# Altium schematic sheet IsolatedPeltierDriver.SchDoc
size A4
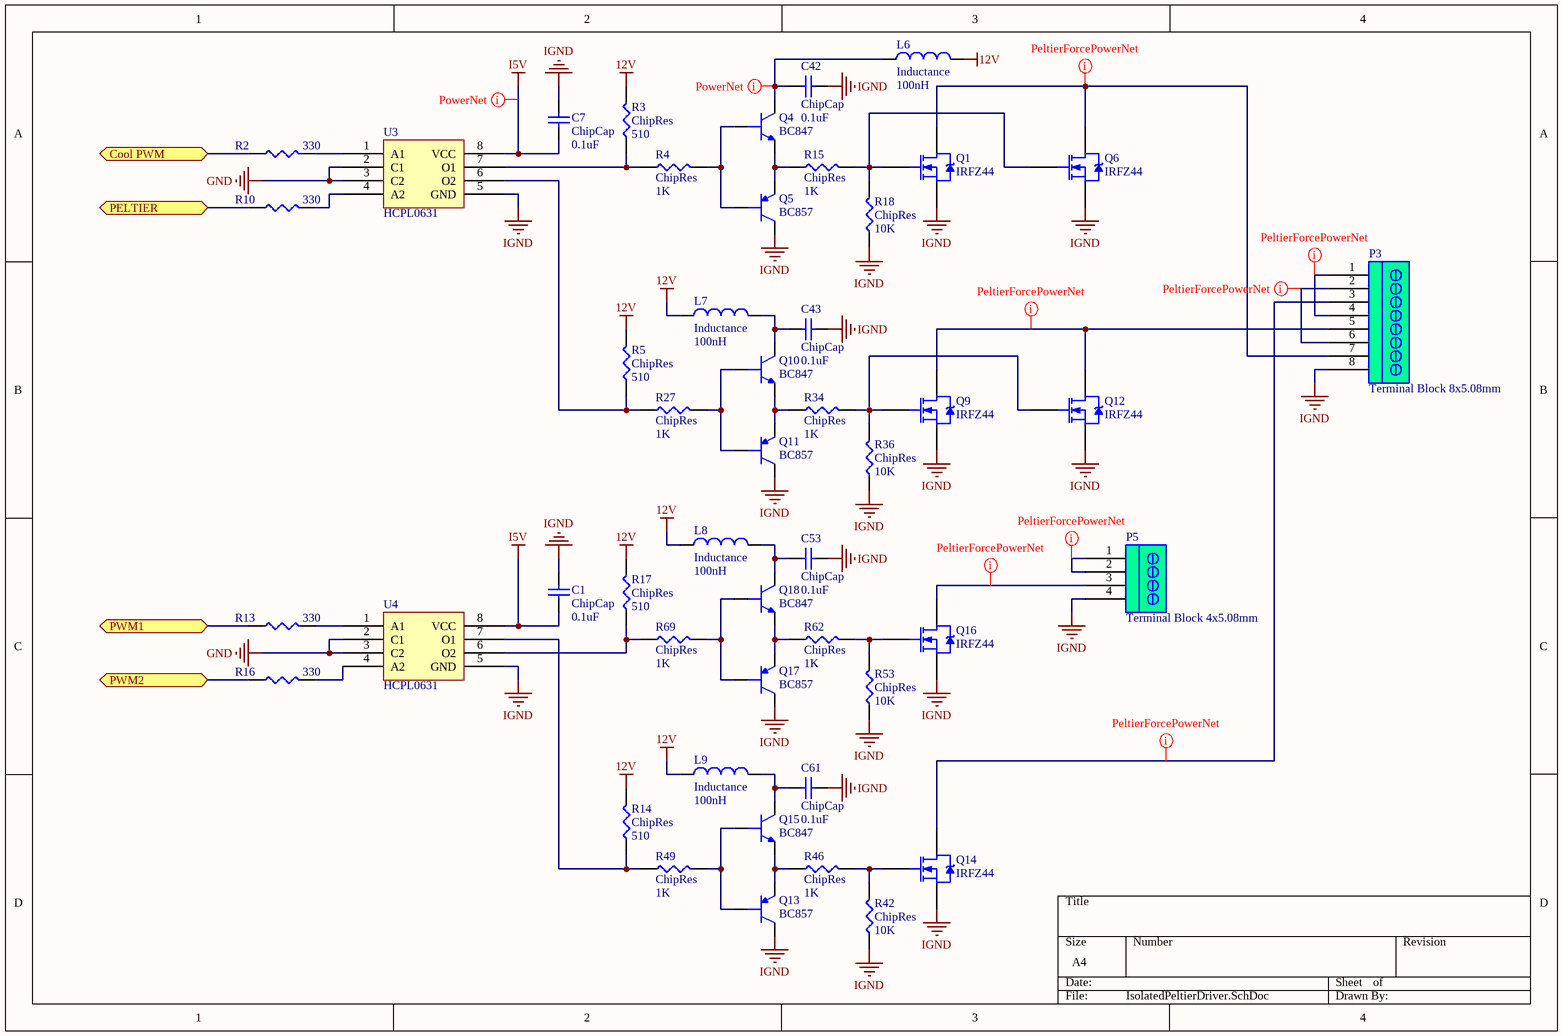
[diagram p0: IsolatedPeltierDriver.SchDoc]

## Parts
C1  ChipCap  value 0.1uF  [CAP0805]
C7  ChipCap  value 0.1uF  [CAP0805]
C42  ChipCap  value 0.1uF  [CAP0805]
C43  ChipCap  value 0.1uF  [CAP0805]
C53  ChipCap  value 0.1uF  [CAP0805]
C61  ChipCap  value 0.1uF  [CAP0805]
L6  Inductance  value 100nH  [CM45]
L7  Inductance  value 100nH  [CM45]
L8  Inductance  value 100nH  [CM45]
L9  Inductance  value 100nH  [CM45]
P3  Terminal Block 8x5.08mm  [SOCKET 8x5.08]
P5  Terminal Block 4x5.08mm  [Socket 4x5.08]
Q1  IRFZ44  [TO-263AB]
Q4  BC847  [SOT23]
Q5  BC857  [SOT23]
Q6  IRFZ44  [TO-263AB]
Q9  IRFZ44  [TO-263AB]
Q10  BC847  [SOT23]
Q11  BC857  [SOT23]
Q12  IRFZ44  [TO-263AB]
Q13  BC857  [SOT23]
Q14  IRFZ44  [TO-263AB]
Q15  BC847  [SOT23]
Q16  IRFZ44  [TO-263AB]
Q17  BC857  [SOT23]
Q18  BC847  [SOT23]
R2  value 330  [RES0805]  (hidden comment: ChipRes)
R3  ChipRes  value 510  [RES0805]
R4  ChipRes  value 1K  [RES0805]
R5  ChipRes  value 510  [RES0805]
R10  value 330  [RES0805]  (hidden comment: ChipRes)
R13  value 330  [RES0805]  (hidden comment: ChipRes)
R14  ChipRes  value 510  [RES0805]
R15  ChipRes  value 1K  [RES0805]
R16  value 330  [RES0805]  (hidden comment: ChipRes)
R17  ChipRes  value 510  [RES0805]
R18  ChipRes  value 10K  [RES0805]
R27  ChipRes  value 1K  [RES0805]
R34  ChipRes  value 1K  [RES0805]
R36  ChipRes  value 10K  [RES0805]
R42  ChipRes  value 10K  [RES0805]
R46  ChipRes  value 1K  [RES0805]
R49  ChipRes  value 1K  [RES0805]
R53  ChipRes  value 10K  [RES0805]
R62  ChipRes  value 1K  [RES0805]
R69  ChipRes  value 1K  [RES0805]
U3  HCPL0631  [SOIC8]
U4  HCPL0631  [SOIC8]

## Ports
Cool PWM, PELTIER, PWM1, PWM2

## Nets
12V: L6.1 L7.2 L8.2 L9.2 R3.2 R5.2 R14.2 R17.2
GND: U3.2(C1) U3.3(C2) U4.2(C1) U4.3(C2)
I5V: C1.2 C7.2 U3.8(VCC) U4.8(VCC)
IGND: C1.1 C7.1 C42.2 C43.2 C53.2 C61.2 P3.8 P5.4 Q1.3(S) Q5.3 Q6.3(S) Q9.3(S) Q11.3 Q12.3(S) Q13.3 Q14.3(S) Q16.3(S) Q17.3 R18.1 R36.1 R42.1 R53.1 U3.5(GND) U4.5(GND)
Cool PWM: R2.1 ; port Cool PWM
PELTIER: R10.1 ; port PELTIER
PWM1: R13.1 ; port PWM1
PWM2: R16.1 ; port PWM2
NetC42_1: C42.1 L6.2 Q4.3
NetC43_1: C43.1 L7.1 Q10.3
NetC53_1: C53.1 L8.1 Q18.3
NetC61_1: C61.1 L9.1 Q15.3
NetP3_1: P3.1 P3.4
NetP3_2: P3.2 P3.6
NetP3_3: P3.3 Q14.2(D)
NetP3_5: P3.5 Q9.2(D) Q12.2(D)
NetP3_7: P3.7 Q1.2(D) Q6.2(D)
NetP5_1: P5.1 P5.2
NetP5_3: P5.3 Q16.2(D)
NetQ1_1: Q1.1(G) Q6.1(G) R15.2 R18.2
NetQ4_1: Q4.1 Q5.1 R4.2
NetQ4_2: Q4.2 Q5.2 R15.1
NetQ9_1: Q9.1(G) Q12.1(G) R34.2 R36.2
NetQ10_1: Q10.1 Q11.1 R27.2
NetQ10_2: Q10.2 Q11.2 R34.1
NetQ13_1: Q13.1 Q15.1 R49.2
NetQ13_2: Q13.2 Q15.2 R46.1
NetQ14_1: Q14.1(G) R42.2 R46.2
NetQ16_1: Q16.1(G) R53.2 R62.2
NetQ17_1: Q17.1 Q18.1 R69.2
NetQ17_2: Q17.2 Q18.2 R62.1
NetR2_2: R2.2 U3.1(A1)
NetR3_1: R3.1 R4.1 U3.7(O1)
NetR5_1: R5.1 R27.1 U3.6(O2)
NetR10_2: R10.2 U3.4(A2)
NetR13_2: R13.2 U4.1(A1)
NetR14_1: R14.1 R49.1 U4.7(O1)
NetR16_2: R16.2 U4.4(A2)
NetR17_1: R17.1 R69.1 U4.6(O2)

## Layout directives
net class PeltierForcePowerNet: NetP3_1, NetP3_2, NetP3_3, NetP3_5, NetP3_7, NetP5_1, NetP5_3
net class Undefined: I5V, NetC42_1

## Library data of the parts
C1 C7 C42 C43 C53 C61 = ChipCap: Capacitor; Published: 8-Jun-2000; LatestRevisionDate: 17-Jul-2002; LatestRevisionNote: Re-released for DXP Platform.; PackageReference: RAD-0.3; Publisher: Altium Limited
L6-L9 = ChipInductance
P3 = Socket_8x5.08_RA_2Wall: Terminal Block Socket Right Angle 8x5.08mm 2-Wall
P5 = Socket_4x5.08_RA_2Wall: Terminal Block Socket Right Angle 4x5.08mm 2-Wall
Q1 Q6 Q9 Q12 Q14 Q16 = IRFZ44: HEXFET N-Channel Power MOSFET; Note: Pin 2 is electrically connected to pin 4.; Published: 8-Jun-2000; LatestRevisionDate: 17-Jul-2002; LatestRevisionNote: Re-released for DXP Platform.; DatasheetVersion: PD-9.510C; PackageVersion: Feb-1997; PackageReference: TO-220AB; Publisher: Altium Limited; PackageDescription: TO, Thru-Hole, Vertical, Heatsink Mounted; 3 In-Line Leads; Pitch 2.54 mm; ComponentLink1Description: Manufacturer Link; ComponentLink1URL: http://www.irf.com/; ComponentLink2Description: Datasheet; ComponentLink2URL: http://www.irf.com/product-info/datasheets/data/irfz44.pdf
Q4 Q10 Q15 Q18 = BC847: NPN transistor
Q5 Q11 Q13 Q17 = BC857: PNP Transistor
R2-R5 R10 R13-R18 R27 R34 R36 R42 R46 R49 R53 R62 R69 = ChipRes: Chip resistor
U3 U4 = HCPL0631: 2-channel opto-coupler